# EAGLE design amp_tda2030_2ch_ocl (EAGLE 9.6.2)
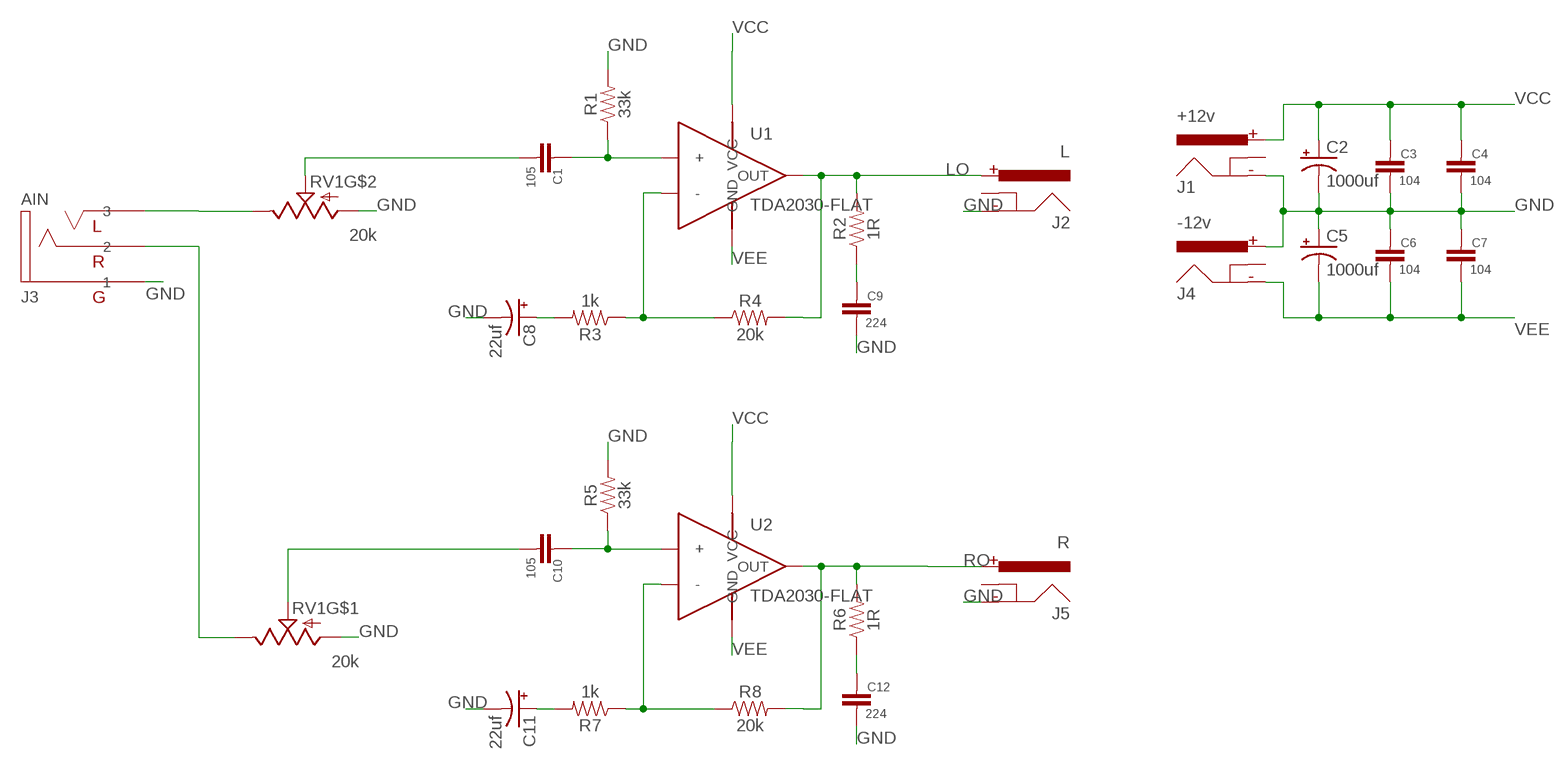
[diagram p0: schematic, sheet 1]

## Parts
C1  105  CAP_P  [CAP_5MM]
C2  1000uf  CAP5MM  [CAP_5MM_10D]
C3  104  CAP_SMDC0603  [C0603]
C4  104  CAP_SMDC0603  [C0603]
C5  1000uf  CAP5MM  [CAP_5MM_10D]
C6  104  CAP_SMDC0603  [C0603]
C7  104  CAP_SMDC0603  [C0603]
C8  22uf  CAP  [CAP_2.5MM]
C9  224  CAP_SMDC0603  [C0603]
C10  105  CAP_P  [CAP_5MM]
C11  22uf  CAP  [CAP_2.5MM]
C12  224  CAP_SMDC0603  [C0603]
J1  +12v  POWER_JACKPTH_LOCK  [POWER_JACK_PTH_LOCK]
J2  L  POWER_JACKPTH_LOCK  [POWER_JACK_PTH_LOCK]
J3  AIN  3.5MM_PHONE  [3.5MM]
J4  -12v  POWER_JACKPTH_LOCK  [POWER_JACK_PTH_LOCK]
J5  R  POWER_JACKPTH_LOCK  [POWER_JACK_PTH_LOCK]
R1  33k  RESISTOR_SMDR0603  [R0603]
R2  1R  RESISTOR_SMDR0603  [R0603]
R3  1k  RESISTOR_SMDR0603  [R0603]
R4  20k  RESISTOR_SMDR0603  [R0603]
R5  33k  RESISTOR_SMDR0603  [R0603]
R6  1R  RESISTOR_SMDR0603  [R0603]
R7  1k  RESISTOR_SMDR0603  [R0603]
R8  20k  RESISTOR_SMDR0603  [R0603]
RV1  20k  POT_DUALPOT_DUAL_GREEN  [POT_DUAL_GREEN]
U1  TDA2030-FLAT  [TO220-FLAT]
U2  TDA2030-FLAT  [TO220-FLAT]

## Nets
GND: C2.- C3.2 C4.2 C5.+ C6.1 C7.1 C8.- C9.2 C11.- C12.2 J1.GND J2.GND J3.P$1 J4.PWR J5.GND R1.2 R5.2 RV1.P$1(A) RV1.P$4(A)
LO: J2.PWR R2.2 R4.2 U1.4(OUT)
N$1: C1.P$1 R1.1 U1.1(+)
N$3: C1.P$2 RV1.P$5(S)
N$4: C10.P$2 RV1.P$2(S)
N$6: C8.+ R3.2
N$7: R3.1 R4.1 U1.2(-)
N$8: J3.P$3 RV1.P$6(E)
N$9: J3.P$2 RV1.P$3(E)
N$11: C10.P$1 R5.1 U2.1(+)
N$14: C9.1 R2.1
N$16: C11.+ R7.2
N$17: R7.1 R8.1 U2.2(-)
N$19: C12.1 R6.1
RO: J5.PWR R6.2 R8.2 U2.4(OUT)
VCC: C2.+ C3.1 C4.1 J1.PWR U1.5(VCC) U2.5(VCC)
VEE: C5.- C6.2 C7.2 J4.GND U1.3(GND) U1.TAB(GND) U2.3(GND) U2.TAB(GND)
Unconnected: J1.GNDBREAK J2.GNDBREAK J4.GNDBREAK J5.GNDBREAK

## Library data of the parts
C1 C10 = Capacitors:CAP_P
C2 C5 C8 C11 = Capacitors:CAP
C3 C4 C6 C7 C9 C12 = Capacitors:CAP_SMD
J1 J2 J4 J5 = Connectors:POWER_JACK: Power Jack Connector This is the standard 5.5mm barrel jack for power. The PTH is the most common, proven, reliable, footprint. The Slot footprint only works if the mill layer is transmitted to the PCB fab house so be warned. Here are the connectors we sell at SparkFun: DC Barrel Power Jack/Connector <https://www.sparkfun.com/products/119> (PRT-00119) DC Barrel Power Jack/Connector (SMD) <https://www.sparkfun.com/products/12748> (PRT-12748) DC Barrel Jack Adapter - Breadboard Compatible <https://www.sparkfun.com/products/10811> (PRT-10811) It is used on this SparkFun product (and many, many others): SparkFun RedBoard - Programmed with Arduino <https://www.sparkfun.com/products/12757> (DEV-12757) Also, if you need a mating power supply or connector, please check these out: Wall Adapter Power Supply - 9VDC 650mA <https://www.sparkfun.com/products/298> (TOL-00298) DC Barrel Jack Adapter - Male <https://www.sparkfun.com/products/10287> (PRT-10287); PROD_ID: CONN-08197; SF_ID: PRT-00119
J3 = Connectors:3.5MM_PHONE: 描述： 类型：3.5mm耳机插口 接口：三段式 连接：https://item.szlcsc.com/19296.html
R1-R8 = Resistors:RESISTOR_SMD
RV1 = xmgu2008:POT_DUAL
U1 U2 = IC-Amplifiers:TDA2030: 描述： 类型：音频功率放大器 型号：TDA2030L-TB5-T 电压：±6V ~ 18V 功率：11W x 1 @ 8Ω 封装：TO-220B 温度:-40~85 连接：https://item.szlcsc.com/83273.html

## Board
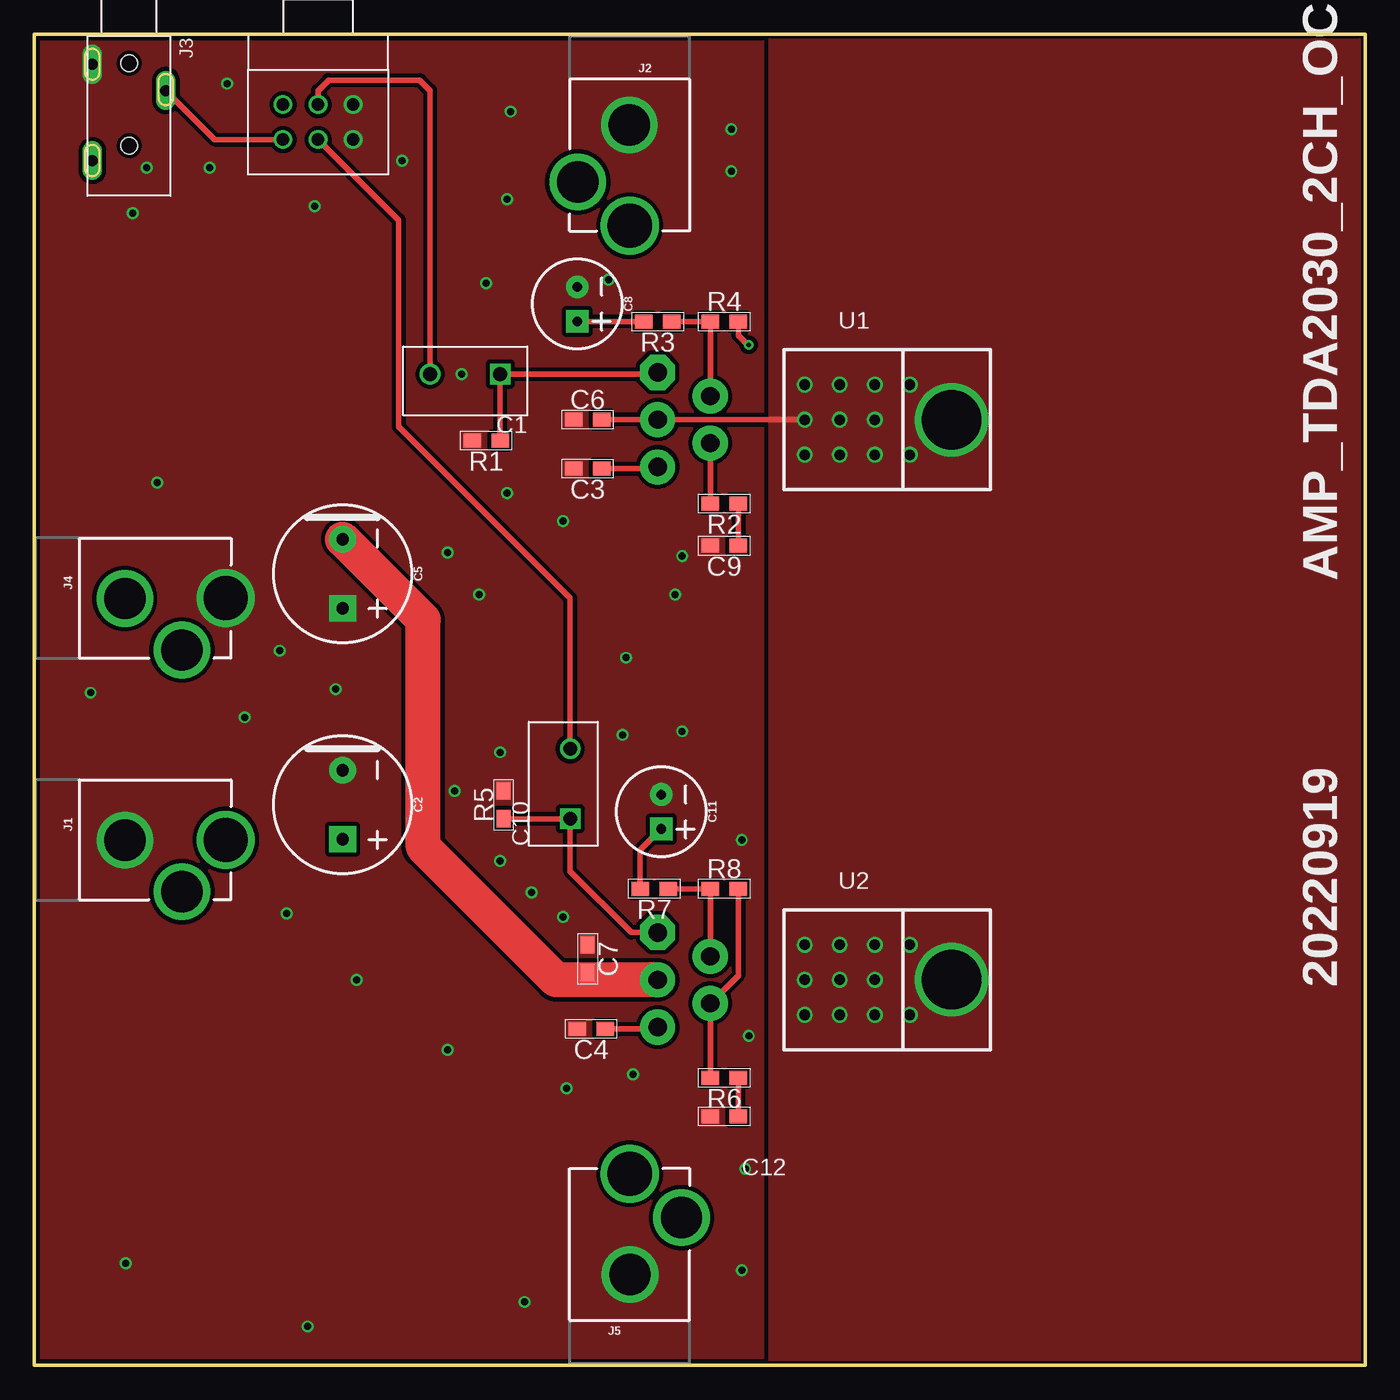
[diagram p1: board, top side]
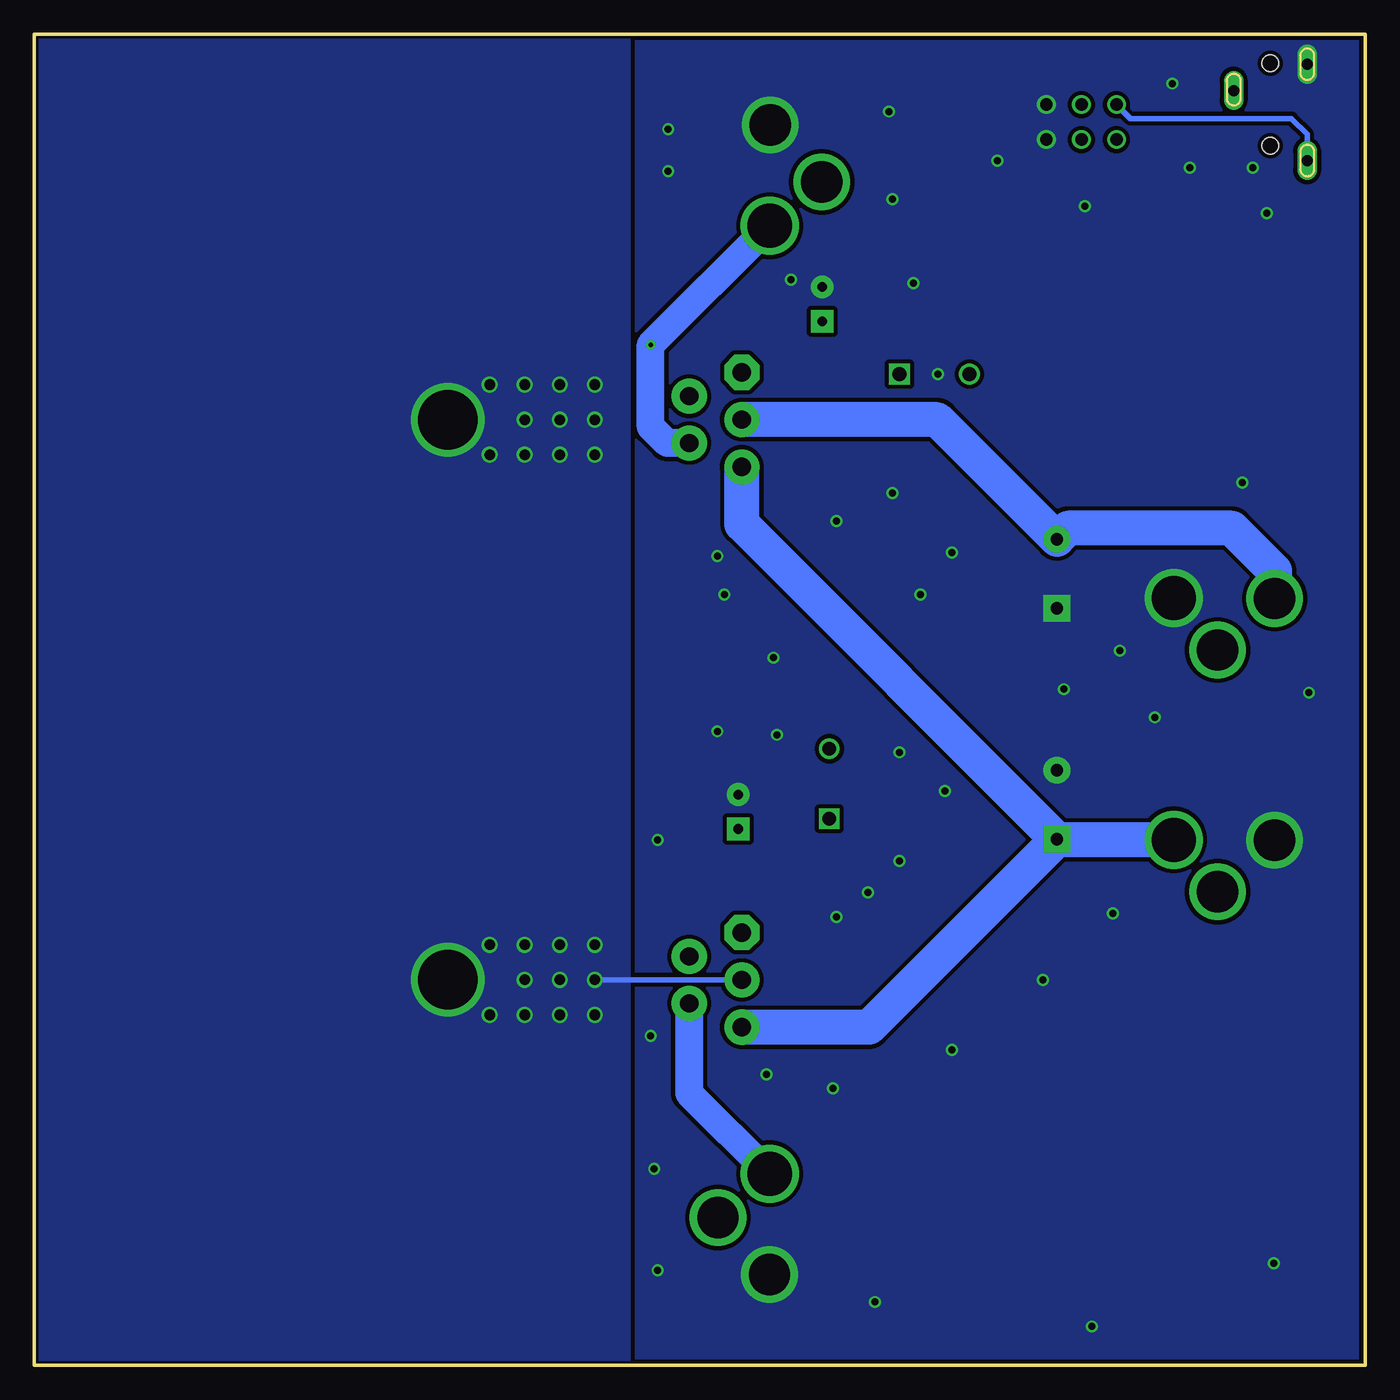
[diagram p2: board, bottom side, seen from below]

Size 96.52 x 96.52 mm. Coordinates in mm from the lower left corner, seen from the top.
Outline: 0,0 0,96.52 96.52,96.52 96.52,0 0,0
Copper layers (1*16): Top 0.035mm / dielectric 1.5mm / Bottom 0.035mm
Design rules "SparkFun-2-Layer-General-JLCPCB": minimum track width 7mil, minimum drill 0.3mm, track to track 7mil, track to pad 7mil, pad to pad 7mil, via to via 7mil, smd to smd 7mil, copper to edge 7mil, drill to drill 7mil, minimum pad ring 7mil, minimum via ring 7mil, stop-mask expansion 3mil, vias tented up to drill 25mil, thermal gap 10mil

### Footprints (pad centres in the part's own frame; a part is rotated, then mirrored left to right if it is on the bottom)
CAP_5MM = drill 1 square: P$1 -2.54,0 | drill 1: P$2 2.54,0
CAP_5MM_10D = drill 0.9 pad 1.93 square: + 2.5,0 | drill 0.9 pad 1.93: - -2.5,0
C0603 = smd 1.27 x 1.016: 1 -1.016,0; 2 1.016,0
CAP_2.5MM = drill 0.7 pad 1.651 square: + 1.25,0 | drill 0.7 pad 1.651: - -1.25,0
POWER_JACK_PTH_LOCK = drill 2.997 pad 4.115: GND 0.025,6.557; GNDBREAK 3.762,10.7 | drill 3.2 pad 4.115: PWR 0,13.878
3.5MM = drill 0.8 pad 1.422 long: P$1 -2.921,-2.667; P$2 -1.016,2.667; P$3 4.064,-2.667 | hole 1.2: -3,0; 3,0
R0603 = smd 1.27 x 1.016: 1 -1.016,0; 2 1.016,0
POT_DUAL_GREEN = drill 0.9: P$1 -2.54,2.54; P$2 0,2.54; P$3 2.54,2.54; P$4 -2.54,0; P$5 0,0; P$6 2.54,0
TO220-FLAT = drill 1.321 pad 2.54 octagon: 1 -3.429,-3.556 | drill 1.321 pad 2.54: 2 -1.702,0.254; 3 0,-3.556; 4 1.702,0.254; 5 3.429,-3.556 | drill 4.318: TAB 0,17.78

### Placement (x,y rotation side)
C1  31.24,71.88 180 top
C2  22.35,40.64 270 top
C3  40.13,65.02 180 top
C4  40.39,24.38 180 top
C5  22.35,57.4 270 top
C6  40.13,68.58 0 top
C7  40.13,29.46 270 top
C8  39.37,76.96 270 top
C9  50.04,59.44 180 top
C10  38.86,42.16 90 top
C11  45.47,40.13 270 top
C12  50.04,18.03 180 top
J1  0,38.1 270 top
J2  43.18,96.52 180 top
J3  6.86,91.44 270 top
J4  0,55.63 270 top
J5  43.18,0 0 top
R1  32.77,67.06 180 top
R2  50.04,62.48 180 top
R3  45.21,75.69 180 top
R4  50.04,75.69 0 top
R5  34.04,40.64 90 top
R6  50.04,20.83 180 top
R7  44.96,34.54 180 top
R8  50.04,34.54 0 top
RV1  20.57,91.44 180 top
U1  48.77,68.58 270 top
U2  48.77,27.94 270 top

### Tracks (layer width: path | path; a pad name or v marks a point on that pad's centre or on a via)
GND  (via drill 0.51)
  other vias: 34.54,90.93 6.6,7.37 19.81,2.79 15.24,46.99 33.78,44.45 38.35,32.51 36.07,34.29 33.78,36.58 30.48,41.66 42.67,45.72 46.99,45.97 51.31,38.1 51.82,23.88 51.56,14.22 43.43,21.08 23.37,27.94 29.97,22.86 38.61,20.07 18.29,32.77 21.84,49.02 29.97,58.93 32.26,55.88 42.93,51.31 46.48,55.88 46.99,58.67 38.35,61.21 34.29,63.25 32.77,78.49 30.99,71.88 34.29,84.58 26.67,87.38 20.32,84.07 12.7,86.87 8.13,86.87 13.97,92.96 7.11,83.57 8.89,64.01 4.06,48.77 17.78,51.82 50.55,86.61 50.55,89.66 41.66,78.74 35.56,4.57 51.31,6.86
  pour Top (isolate 0.305, rank 2, no thermals): 0,0 0,96.52 96.52,96.52 96.52,0
  pour Bottom (isolate 0.305, rank 2, no thermals): 0,0 0,96.52 96.52,96.52 96.52,0
LO  (via drill 0.35)
  Top 0.406: R4.2 51.05,74.68 51.72,74.01 v51.82,74.01 | R2.2 U1.4
  Bottom 2.032: U1.4 50.62,66.88 51.82,68.07 v51.82,74.01 J2.PWR
N$1
  Top 0.406: R1.1 C1.P$1 45.09,71.88 U1.1
N$3
  Top 0.406: RV1.P$5 20.57,92.46 21.34,93.22 27.94,93.22 28.7,92.46 C1.P$2
N$4
  Top 0.406: RV1.P$2 26.42,83.06 26.42,68.07 38.86,55.63 C10.P$2
N$6
  Top 0.406: R3.2 39.39,75.69 C8.+
N$7
  Top 0.406: U1.2 R4.1 R3.1
N$8
  Bottom 0.406: J3.P$3 4.19,89.28 5.33,90.42 17.02,90.42 RV1.P$6
N$9
  Top 0.406: J3.P$2 13.08,88.9 RV1.P$3
N$11
  Top 0.406: U2.1 43.31,31.37 38.86,35.81 C10.P$1 R5.1
N$14
  Top 0.406: R2.1 C9.1
N$16
  Top 0.406: R7.2 43.94,37.36 C11.+
N$17
  Top 0.406: U2.2 R8.1 R7.1
N$19
  Top 0.406: C12.1 R6.1
RO
  Top 0.406: R8.2 51.05,28.27 U2.4 R6.2
  Bottom 2.032: U2.4 49.02,19.72 J5.PWR
VCC
  Top 0.406: C3.1 45.09,65.02 U1.5 | C4.1 45.09,24.38 U2.5
  Bottom 2.54: J1.PWR 22.31,38.1 C2.+ | C2.+ 45.21,61 U1.5 | C2.+ 35.98,24.51 U2.5
VEE  (via drill 0.76)
  Top 0.406: C6.2 U1.3 v55.88,68.58 | C7.2 40.39,28.45 40.89,27.94
  Top 2.54: U2.3 40.89,27.94 37.85,27.94 28.19,37.59 28.19,54.06 C5.-
  Bottom 0.406: U2.3 v55.88,27.94
  Bottom 2.54: J4.GND 6.56,57.61 9.65,60.71 21.55,60.71 C5.- 31.03,68.58 U1.3
  other vias: 55.88,71.12 58.42,71.12 60.96,71.12 63.5,71.12 55.88,66.04 58.42,66.04 58.42,68.58 60.96,68.58 60.96,66.04 63.5,66.04 55.88,30.48 58.42,30.48 60.96,30.48 63.5,30.48 60.96,27.94 58.42,27.94 55.88,25.4 58.42,25.4 60.96,25.4 63.5,25.4
  pour Bottom (no thermals): 53.34,0 53.34,96.52 96.52,96.52 96.52,0
  pour Top (no thermals): 53.34,0 53.34,96.52 96.52,96.52 96.52,0

### Text on the board
tPlace: AMP_TDA2030_2CH_OCL | 20220919